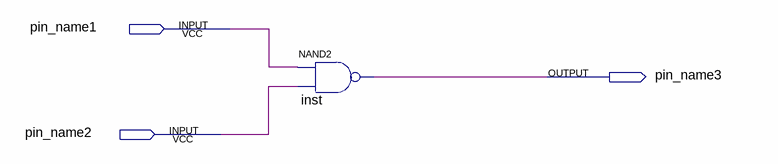
[diagram p0: schematic sheet]
// Quartus schematic nand_gate.bdf as structural Verilog: 1 symbols, 3 pins
module nand_gate (
  input  pin_name1,
  input  pin_name2,
  output pin_name3
);

  nand inst (pin_name3, pin_name1, pin_name2);
endmodule
